# EAGLE design soil_res_scheme (EAGLE 7.6.0)
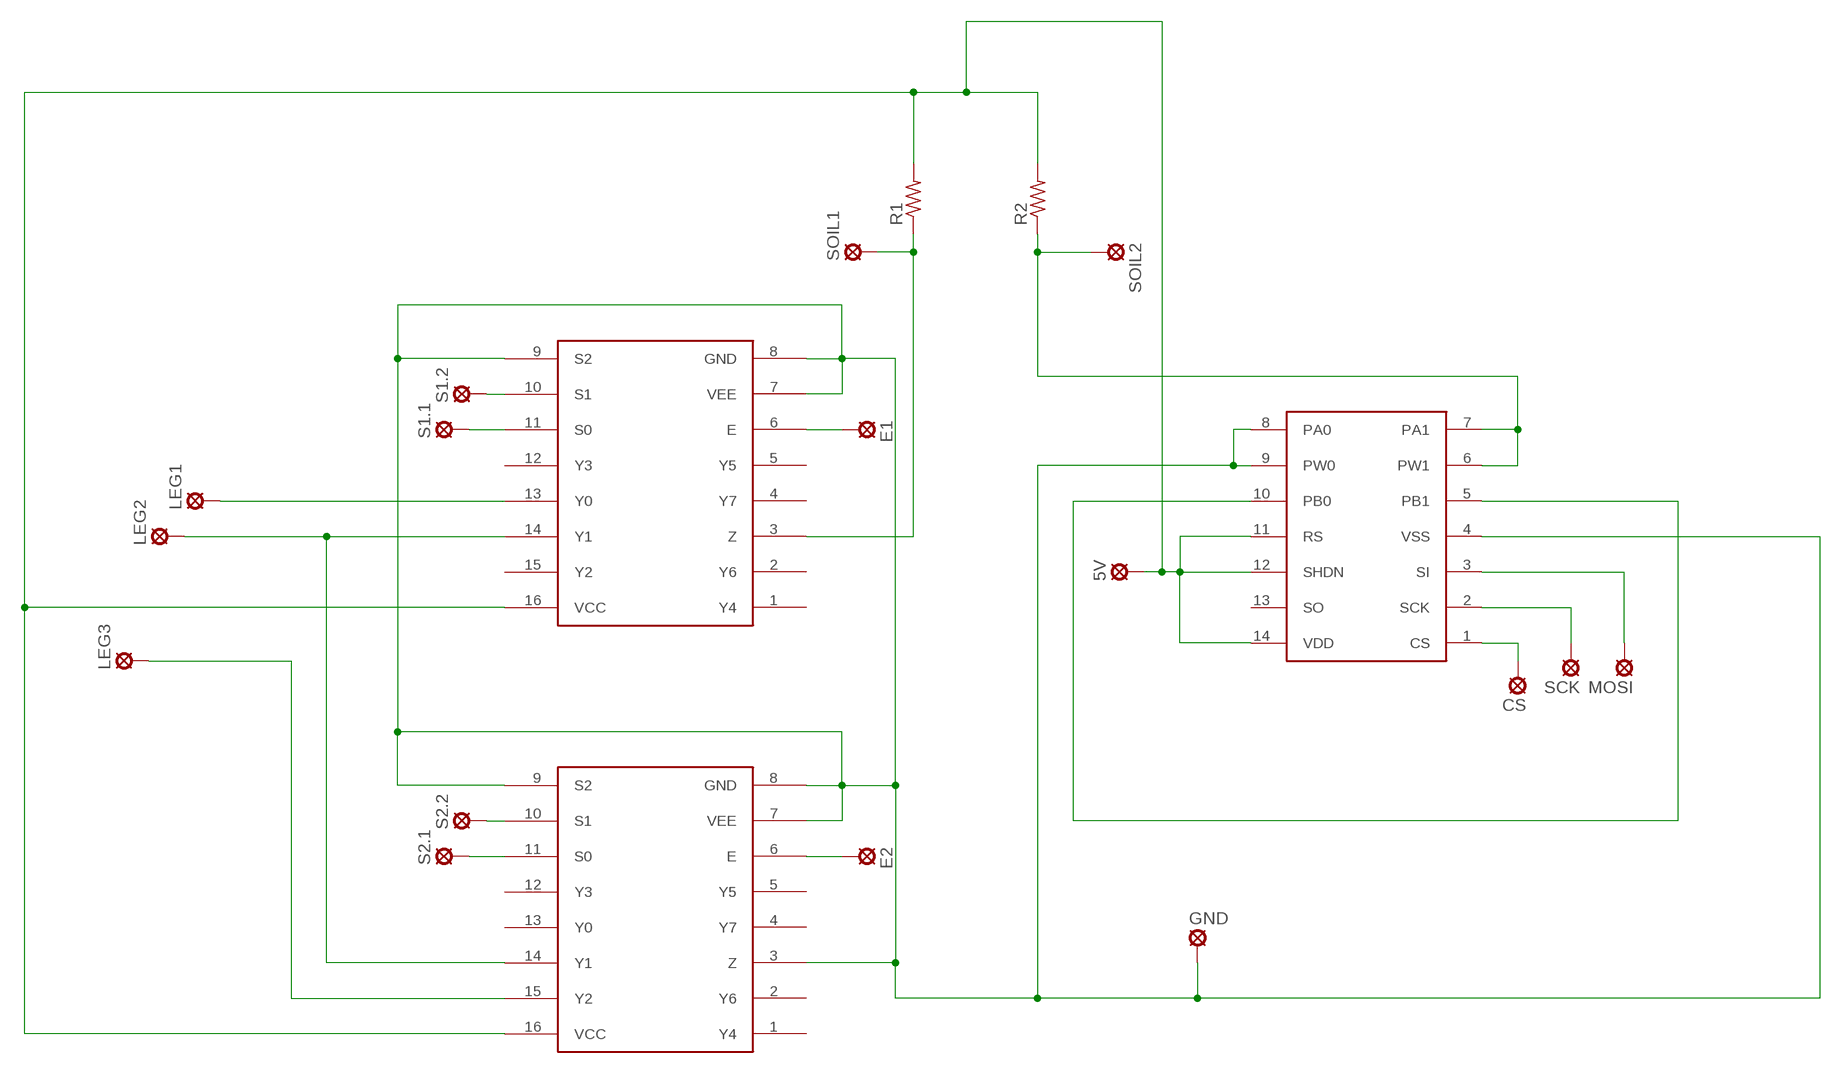
[diagram p0: schematic, sheet 1]

## Parts
5V  LSP10  [LSP10]
CS  LSP10  [LSP10]
E1  LSP10  [LSP10]
E2  LSP10  [LSP10]
GND  LSP10  [LSP10]
LEG1  LSP10  [LSP10]
LEG2  LSP10  [LSP10]
LEG3  LSP10  [LSP10]
MOSI  LSP10  [LSP10]
R1  R-US_0207/10  [0207/10]
R2  R-US_0207/10  [0207/10]
S1.1  LSP10  [LSP10]
S1.2  LSP10  [LSP10]
S2.1  LSP10  [LSP10]
S2.2  LSP10  [LSP10]
SCK  LSP10  [LSP10]
SOIL1  LSP10  [LSP10]
SOIL2  LSP10  [LSP10]
U$1  MCP42100!  [DIL14]
U$2  74HC4051!  [DIL16]
U$3  74HC4051!  [DIL16]

## Nets
5V: 5V.MP R1.2 R2.2 U$1.11(RS) U$1.12(SHDN) U$1.14(VDD) U$2.16(VCC) U$3.16(VCC)
CS: CS.MP U$1.1(CS)
E1: E1.MP U$2.6(E)
E2: E2.MP U$3.6(E)
GND: GND.MP U$1.4(VSS) U$1.8(PA0) U$1.9(PW0) U$2.7(VEE) U$2.8(GND) U$2.9(S2) U$3.3(Z) U$3.7(VEE) U$3.8(GND) U$3.9(S2)
MOSI: MOSI.MP U$1.3(SI)
N$1: S2.2.MP U$3.10(S1)
N$2: S2.1.MP U$3.11(S0)
N$3: S1.1.MP U$2.11(S0)
N$4: S1.2.MP U$2.10(S1)
N$5: LEG1.MP U$2.13(Y0)
N$6: LEG2.MP U$2.14(Y1) U$3.14(Y1)
N$7: LEG3.MP U$3.15(Y2)
N$8: U$1.5(PB1) U$1.10(PB0)
SCK: SCK.MP U$1.2(SCK)
SOIL-1: R1.1 SOIL1.MP U$2.3(Z)
SOIL-2: R2.1 SOIL2.MP U$1.6(PW1) U$1.7(PA1)
Unconnected: U$1.13(SO) U$2.1(Y4) U$2.2(Y6) U$2.4(Y7) U$2.5(Y5) U$2.12(Y3) U$2.15(Y2) U$3.1(Y4) U$3.2(Y6) U$3.4(Y7) U$3.5(Y5) U$3.12(Y3) U$3.13(Y0)

## Library data of the parts
5V CS E1 E2 GND LEG1-LEG3 MOSI S1.1 S1.2 S2.1 S2.2 SCK SOIL1 SOIL2 = solpad:LSP10: SOLDER PAD drill 1.0 mm, distributor Buerklin, 12H555
R1 R2 = rcl:R-US_: RESISTOR, American symbol
U$1 = elements_cs2016:MCP42100!
U$2 U$3 = elements_cs2016:74HC4051!

## Board
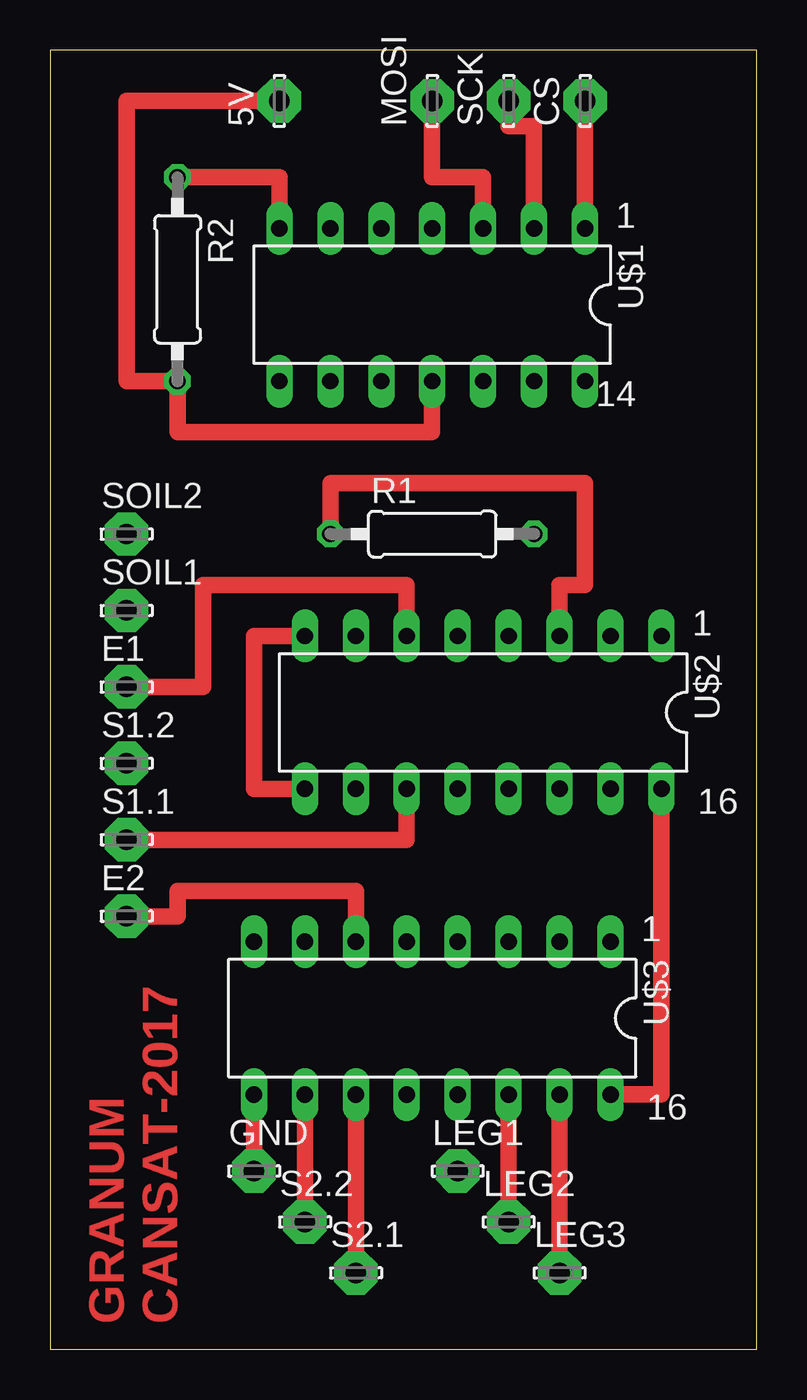
[diagram p1: board, top side]
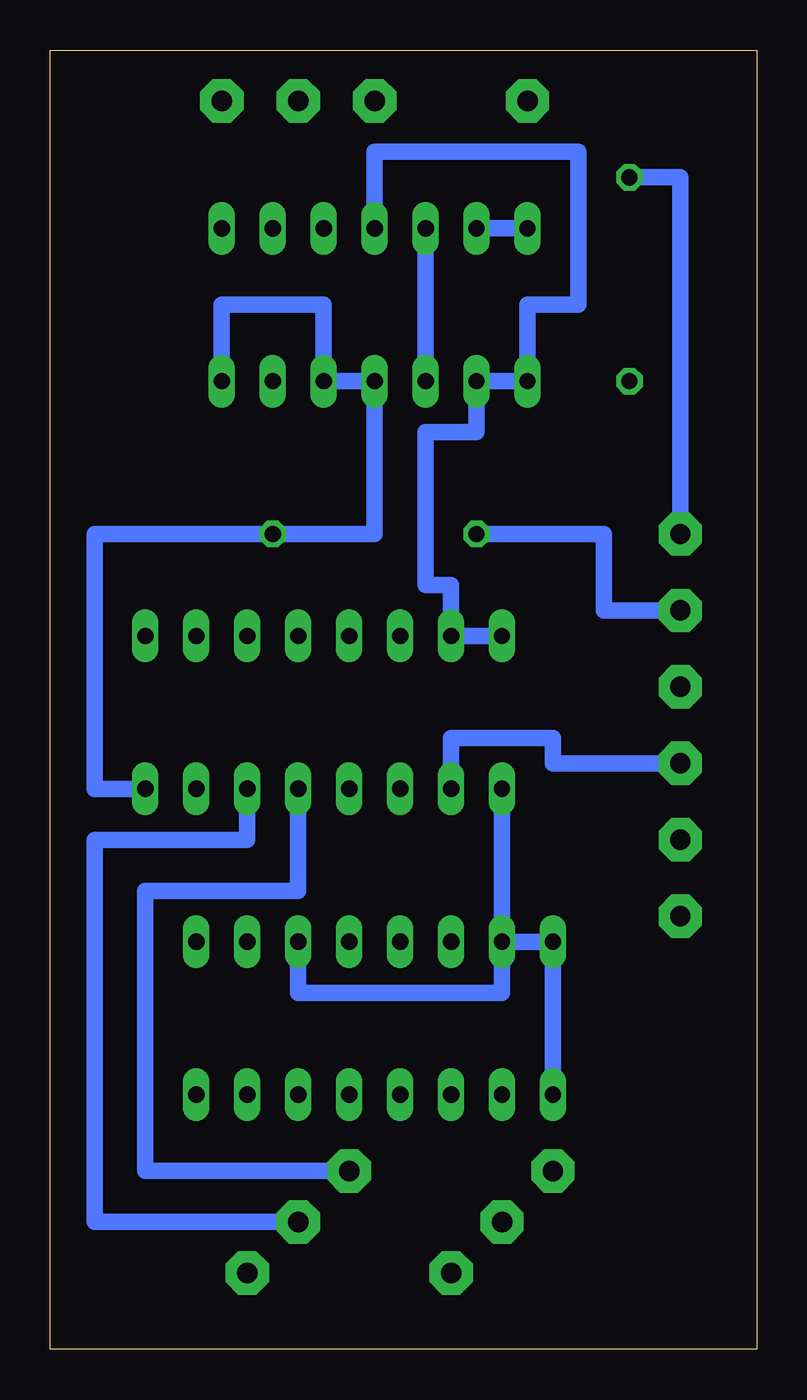
[diagram p2: board, bottom side, seen from below]

Size 35.23 x 64.76 mm. Coordinates in mm from the lower left corner, seen from the top.
Outline: 0,0 35.23,0 35.23,64.76 0,64.76 0,0
Copper layers (1*16): Top 0.035mm / dielectric 1.5mm / Bottom 0.035mm
Design rules "default": minimum track width 10mil, minimum drill 24mil, track to track 8mil, track to pad 8mil, pad to pad 8mil, via to via 8mil, smd to smd 8mil, copper to edge 40mil, drill to drill 8mil, minimum pad ring 10mil, minimum via ring 8mil, stop-mask expansion 4mil, vias tented up to drill 0mil, thermal gap 10mil

### Footprints (pad centres in the part's own frame; a part is rotated, then mirrored left to right if it is on the bottom)
LSP10 = drill 1.016 pad 2.159 octagon: MP 0,0
0207/10 = drill 0.813 octagon: 1 -5.08,0; 2 5.08,0
DIL14 = drill 0.813 long: 1 -7.62,-3.81; 2 -5.08,-3.81; 3 -2.54,-3.81; 4 0,-3.81; 5 2.54,-3.81; 6 5.08,-3.81; 7 7.62,-3.81; 8 7.62,3.81; 9 5.08,3.81; 10 2.54,3.81; 11 0,3.81; 12 -2.54,3.81; 13 -5.08,3.81; 14 -7.62,3.81
DIL16 = drill 0.813 long: 1 -8.89,-3.81; 2 -6.35,-3.81; 3 -3.81,-3.81; 4 -1.27,-3.81; 5 1.27,-3.81; 6 3.81,-3.81; 7 6.35,-3.81; 8 8.89,-3.81; 9 8.89,3.81; 10 6.35,3.81; 11 3.81,3.81; 12 1.27,3.81; 13 -1.27,3.81; 14 -3.81,3.81; 15 -6.35,3.81; 16 -8.89,3.81

### Placement (x,y rotation side)
5V  11.43,62.23 90 top
CS  26.67,62.23 90 top
E1  3.81,33.02 0 top
E2  3.81,21.59 0 top
GND  10.16,8.89 0 top
LEG1  20.32,8.89 0 top
LEG2  22.86,6.35 0 top
LEG3  25.4,3.81 0 top
MOSI  19.05,62.23 90 top
R1  19.05,40.64 0 top
R2  6.35,53.34 270 top
S1.1  3.81,25.4 0 top
S1.2  3.81,29.21 0 top
S2.1  15.24,3.81 0 top
S2.2  12.7,6.35 0 top
SCK  22.86,62.23 90 top
SOIL1  3.81,36.83 0 top
SOIL2  3.81,40.64 0 top
U$1  19.05,52.07 180 top
U$2  21.59,31.75 180 top
U$3  19.05,16.51 180 top

### Tracks (layer width: path | path; a pad name or v marks a point on that pad's centre or on a via)
5V
  Top 0.813: U$2.16 30.48,12.7 U$3.16 | U$1.11 19.05,45.72 6.35,45.72 R2.2 3.81,48.26 3.81,62.23 5V.MP
  Bottom 0.813: U$1.14 26.67,52.07 21.59,52.07 U$1.12 U$1.11 19.05,40.64 R1.2 33.02,40.64 33.02,27.94 U$2.16
CS
  Top 0.813: U$1.1 CS.MP
E1
  Top 0.813: U$2.6 17.78,38.1 7.62,38.1 7.62,33.02 E1.MP
E2
  Top 0.813: E2.MP 6.35,21.59 6.35,22.86 15.24,22.86 U$3.6
GND
  Top 0.813: U$3.9 GND.MP | U$2.9 10.16,27.94 10.16,35.56 U$2.8
  Bottom 0.813: U$2.8 U$2.7 15.24,38.1 16.51,38.1 16.51,45.72 13.97,45.72 U$1.9 U$1.8 11.43,52.07 8.89,52.07 8.89,59.69 19.05,59.69 U$1.4 | U$3.7 U$3.8 U$3.9 | U$3.7 12.7,17.78 22.86,17.78 U$3.3 | U$2.9 U$3.7
MOSI
  Top 0.813: U$1.3 21.59,58.42 19.05,58.42 MOSI.MP
N$1
  Top 0.813: U$3.10 S2.2.MP
N$2
  Top 0.813: U$3.11 S2.1.MP
N$3
  Top 0.813: S1.1.MP 17.78,25.4 U$2.11
N$4
  Bottom 0.813: U$2.10 15.24,30.48 10.16,30.48 10.16,29.21 S1.2.MP
N$5
  Bottom 0.813: U$2.13 22.86,22.86 30.48,22.86 30.48,8.89 LEG1.MP
N$6
  Top 0.813: LEG2.MP U$3.14
  Bottom 0.813: U$2.14 25.4,25.4 33.02,25.4 33.02,6.35 LEG2.MP
N$7
  Top 0.813: U$3.15 LEG3.MP
N$8
  Bottom 0.813: U$1.10 U$1.5
SCK
  Top 0.813: SCK.MP 22.86,60.96 24.13,60.96 U$1.2
SOIL-1
  Top 0.813: U$2.3 25.4,38.1 26.67,38.1 26.67,43.18 13.97,43.18 R1.1
  Bottom 0.813: SOIL1.MP 7.62,36.83 7.62,40.64 R1.1
SOIL-2
  Top 0.813: R2.1 11.43,58.42 U$1.7
  Bottom 0.813: U$1.7 U$1.6 | R2.1 3.81,58.42 SOIL2.MP

### Text on the board
Top: GRANUM / CANSAT-2017